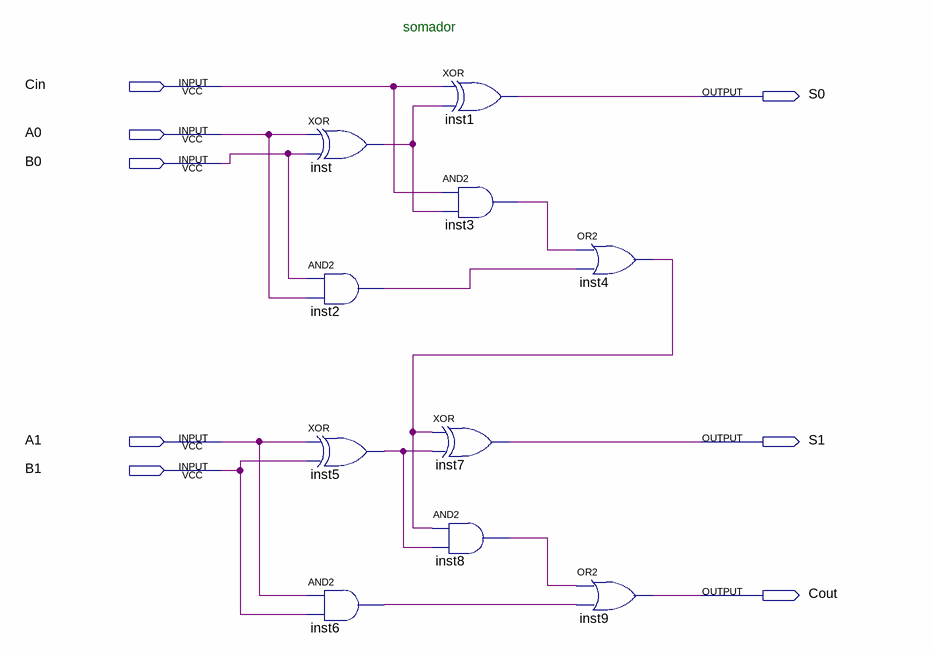
[diagram p0: schematic sheet]
// Quartus schematic Somador.bdf as structural Verilog: 10 symbols, 8 pins
module Somador (
  input  Cin,
  input  A0,
  input  B0,
  input  A1,
  input  B1,
  output S0,
  output S1,
  output Cout
);

  wire inst2_out, inst3_out, inst4_out, inst5_out, inst6_out, inst8_out, inst_out;

  xor inst (inst_out, A0, B0);
  and inst2 (inst2_out, B0, A0);
  xor inst5 (inst5_out, A1, B1);
  and inst6 (inst6_out, A1, B1);
  xor inst1 (S0, Cin, inst_out);
  and inst3 (inst3_out, Cin, inst_out);
  xor inst7 (S1, inst4_out, inst5_out);
  and inst8 (inst8_out, inst4_out, inst5_out);
  or inst4 (inst4_out, inst3_out, inst2_out);
  or inst9 (Cout, inst8_out, inst6_out);

  // Notes on the sheet:
  //   somador
endmodule
